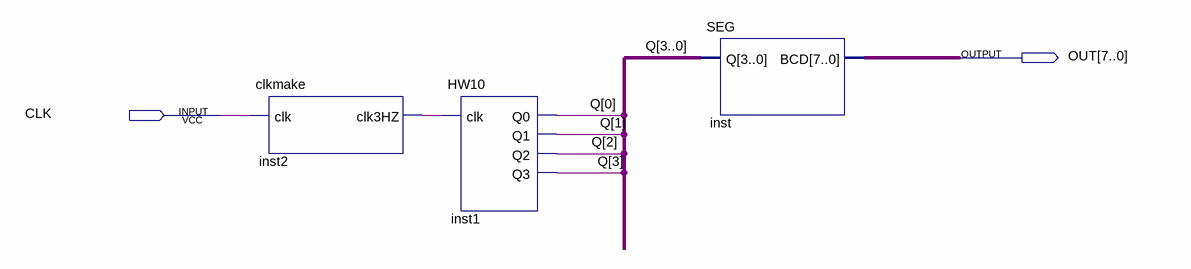
[diagram p0: schematic sheet]
// Quartus schematic HW11.bdf as structural Verilog: 3 symbols, 2 pins
module HW11 (
  input  CLK,
  output [7:0] OUT
);

  wire inst2_clk3hz;
  wire [3:0] Q;

  clkmake inst2 (.clk(CLK), .clk3HZ(inst2_clk3hz));
  HW10 inst1 (.clk(inst2_clk3hz), .Q1(Q[1]), .Q2(Q[2]), .Q3(Q[3]), .Q0(Q[0]));
  SEG inst (.Q(Q), .BCD(OUT));
endmodule
